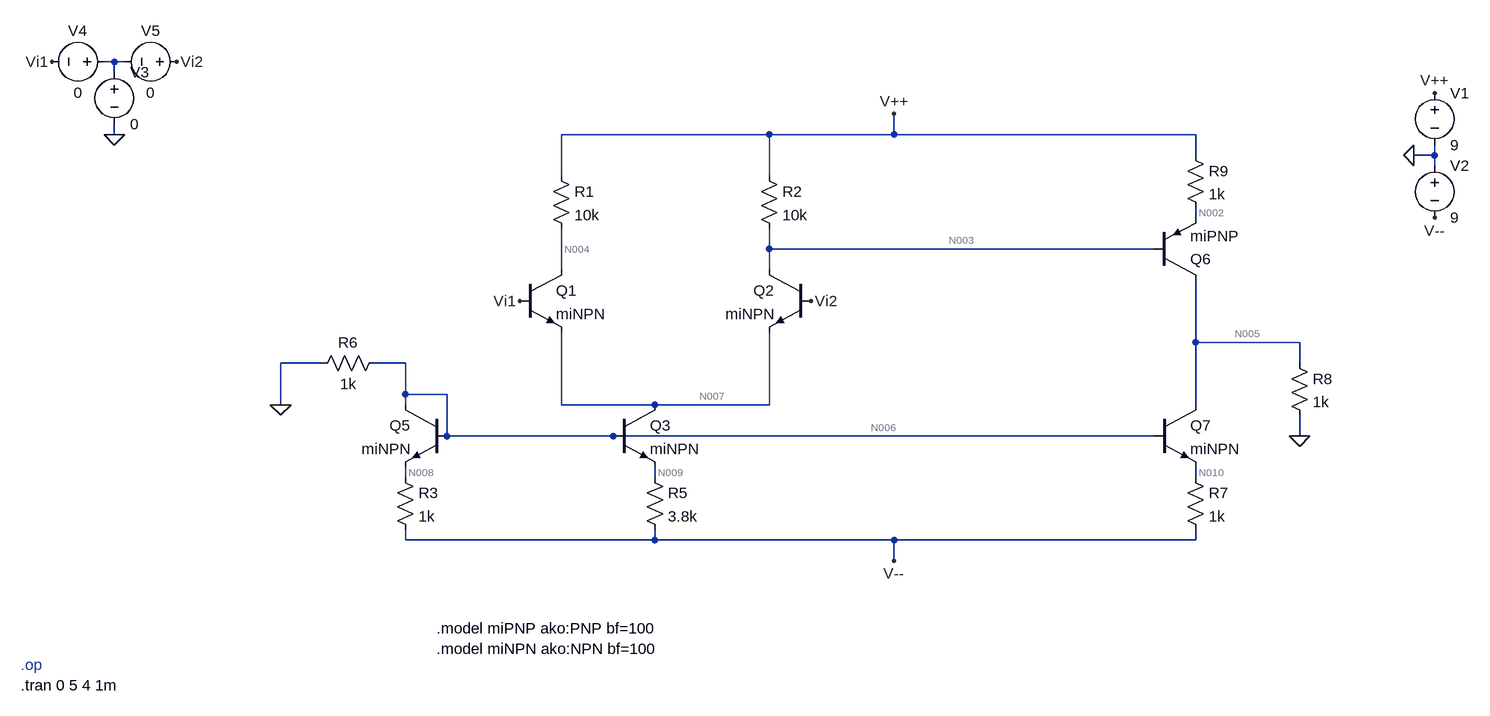
[diagram p0: schematic Draft1.asc]
Draft1.asc, the LTspice schematic file:
Version 4
SHEET 1 1480 768
WIRE -608 -208 -624 -208
WIRE -592 -208 -608 -208
WIRE -608 -192 -608 -208
WIRE -608 -96 -608 -112
WIRE 400 -96 80 -96
WIRE 592 -96 592 -128
WIRE 592 -96 400 -96
WIRE 1056 -96 592 -96
WIRE 1056 -64 1056 -96
WIRE 1424 -64 1424 -80
WIRE 1424 -64 1392 -64
WIRE 1424 -48 1424 -64
WIRE 80 -32 80 -96
WIRE 400 -32 400 -96
WIRE 1056 32 1056 16
WIRE 400 80 400 48
WIRE 992 80 400 80
WIRE 80 112 80 48
WIRE 400 112 400 80
WIRE 1056 224 1056 128
WIRE 1216 224 1056 224
WIRE -288 256 -352 256
WIRE -160 256 -208 256
WIRE 1216 256 1216 224
WIRE -160 304 -160 256
WIRE -96 304 -160 304
WIRE -352 320 -352 256
WIRE -160 320 -160 304
WIRE 80 320 80 208
WIRE 224 320 80 320
WIRE 400 320 400 208
WIRE 400 320 224 320
WIRE 1056 320 1056 224
WIRE -96 368 -96 304
WIRE 160 368 -96 368
WIRE 992 368 160 368
WIRE 1216 368 1216 336
WIRE -160 432 -160 416
WIRE 224 432 224 416
WIRE 1056 432 1056 416
WIRE -160 528 -160 512
WIRE 224 528 224 512
WIRE 224 528 -160 528
WIRE 592 528 224 528
WIRE 1056 528 1056 512
WIRE 1056 528 592 528
WIRE 592 560 592 528
FLAG 1392 -64 0
FLAG 1216 368 0
FLAG -352 320 0
FLAG 1424 -160 V++
FLAG 592 -128 V++
FLAG 1424 32 V--
FLAG 592 560 V--
FLAG -608 -96 0
FLAG -704 -208 Vi1
FLAG 16 160 Vi1
FLAG -512 -208 Vi2
FLAG 464 160 Vi2
SYMBOL npn 16 112 R0
SYMATTR InstName Q1
SYMATTR Value miNPN
SYMBOL npn 464 112 M0
SYMATTR InstName Q2
SYMATTR Value miNPN
SYMBOL res 64 -48 R0
SYMATTR InstName R1
SYMATTR Value 10k
SYMBOL res 384 -48 R0
SYMATTR InstName R2
SYMATTR Value 10k
SYMBOL npn 160 320 R0
SYMATTR InstName Q3
SYMATTR Value miNPN
SYMBOL npn -96 320 M0
SYMATTR InstName Q5
SYMATTR Value miNPN
SYMBOL res -176 416 R0
SYMATTR InstName R3
SYMATTR Value 1k
SYMBOL res 208 416 R0
SYMATTR InstName R5
SYMATTR Value 3.8k
SYMBOL res -192 240 R90
WINDOW 0 0 56 VBottom 2
WINDOW 3 32 56 VTop 2
SYMATTR InstName R6
SYMATTR Value 1k
SYMBOL pnp 992 128 M180
SYMATTR InstName Q6
SYMATTR Value miPNP
SYMBOL npn 992 320 R0
SYMATTR InstName Q7
SYMATTR Value miNPN
SYMBOL res 1040 416 R0
SYMATTR InstName R7
SYMATTR Value 1k
SYMBOL res 1200 240 R0
SYMATTR InstName R8
SYMATTR Value 1k
SYMBOL res 1040 -80 R0
SYMATTR InstName R9
SYMATTR Value 1k
SYMBOL voltage 1424 -176 R0
WINDOW 123 0 0 Left 0
WINDOW 39 0 0 Left 0
SYMATTR InstName V1
SYMATTR Value 9
SYMBOL voltage 1424 -64 R0
WINDOW 123 0 0 Left 0
WINDOW 39 0 0 Left 0
SYMATTR InstName V2
SYMATTR Value 9
SYMBOL voltage -608 -208 R0
WINDOW 123 0 0 Left 0
WINDOW 39 0 0 Left 0
SYMATTR InstName V3
SYMATTR Value 0
SYMBOL voltage -608 -208 R90
WINDOW 0 -32 56 VBottom 2
WINDOW 3 32 56 VTop 2
WINDOW 123 0 0 Left 0
WINDOW 39 0 0 Left 0
SYMATTR InstName V4
SYMATTR Value 0
SYMBOL voltage -496 -208 R90
WINDOW 0 -32 56 VBottom 2
WINDOW 3 32 56 VTop 2
WINDOW 123 0 0 Left 0
WINDOW 39 0 0 Left 0
SYMATTR InstName V5
SYMATTR Value 0
TEXT -112 664 Left 2 !.model miPNP ako:PNP bf=100
TEXT -112 696 Left 2 !.model miNPN ako:NPN bf=100
TEXT -752 720 Left 2 ;.op
TEXT -752 752 Left 2 !.tran 0 5 4 1m

The netlist it stands for:
* Draft1.asc
Q1 N004 Vi1 N007 0 miNPN
Q2 N003 Vi2 N007 0 miNPN
R1 V++ N004 10k
R2 V++ N003 10k
Q3 N007 N006 N009 0 miNPN
Q5 N006 N006 N008 0 miNPN
R3 N008 V-- 1k
R5 N009 V-- 3.8k
R6 N006 0 1k
Q6 N005 N003 N002 0 miPNP
Q7 N005 N006 N010 0 miNPN
R7 N010 V-- 1k
R8 N005 0 1k
R9 V++ N002 1k
V1 V++ 0 9
V2 0 V-- 9
V3 N001 0 0
V4 N001 Vi1 0
V5 Vi2 N001 0
.model NPN NPN
.model PNP PNP
.lib standard.bjt
.model miPNP ako:PNP bf=100
.model miNPN ako:NPN bf=100
* .op
.tran 0 5 4 1m
.backanno
.end

* Results of the author's LTspice run, read from the files saved beside the schematic
* Operating Point, zero values left out:
*   V(n004) = 3.707 V
*   V(n007) = -757.8 mV
*   V(n003) = 4.111 V
*   V(v++) = 9 V
*   V(n006) = -4.12 V
*   V(n009) = -4.896 V
*   V(n008) = -4.931 V
*   V(v--) = -9 V
*   V(n005) = 9.527 mV
*   V(n002) = 4.921 V
*   V(n010) = -4.931 V
*   Ic(Q1) = 529.3 µA
*   Ib(Q1) = 5.293 µA
*   Ie(Q1) = -534.6 µA
*   Ic(Q2) = 529.3 µA
*   Ib(Q2) = 5.293 µA
*   Ie(Q2) = -534.6 µA
*   Ic(Q3) = 1.069 mA
*   Ib(Q3) = 10.69 µA
*   Ie(Q3) = -1.08 mA
*   Ic(Q5) = 4.029 mA
*   Ib(Q5) = 40.29 µA
*   Ie(Q5) = -4.069 mA
*   Ic(Q7) = 4.029 mA
*   Ib(Q7) = 40.29 µA
*   Ie(Q7) = -4.069 mA
*   Ic(Q6) = -4.039 mA
*   Ib(Q6) = -40.39 µA
*   Ie(Q6) = 4.079 mA
*   I(R1) = 529.3 µA
*   I(R2) = 488.9 µA
*   I(R3) = 4.069 mA
*   I(R5) = 1.08 mA
*   I(R6) = -4.12 mA
*   I(R7) = 4.069 mA
*   I(R8) = 9.527 µA
*   I(R9) = 4.079 mA
*   I(V1) = -5.097 mA
*   I(V2) = -9.219 mA
*   I(V3) = -10.59 µA
*   I(V4) = 5.293 µA
*   I(V5) = -5.293 µA